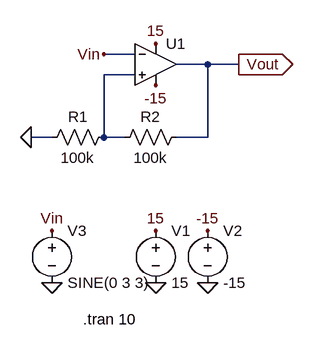
[diagram p0: schematic 1-4.asc]
1-4.asc, the LTspice schematic file:
Version 4
SHEET 1 880 680
WIRE 112 48 64 48
WIRE 224 64 176 64
WIRE 272 64 224 64
WIRE 112 80 64 80
WIRE -16 176 -48 176
WIRE 64 176 64 80
WIRE 96 176 64 176
WIRE 224 176 224 64
WIRE 224 176 176 176
FLAG 144 400 0
FLAG 224 400 0
FLAG 144 320 15
FLAG 224 320 -15
FLAG 144 96 -15
FLAG 144 32 15
FLAG 64 48 Vin
FLAG -48 176 0
FLAG 272 64 Vout
IOPIN 272 64 Out
FLAG -16 320 Vin
FLAG -16 400 0
SYMBOL OpAmps\\UniversalOpAmp2 144 64 R0
SYMATTR InstName U1
SYMBOL voltage 144 304 R0
SYMATTR InstName V1
SYMATTR Value 15
SYMBOL voltage 224 304 R0
SYMATTR InstName V2
SYMATTR Value -15
SYMBOL res 80 160 R90
WINDOW 0 0 56 VBottom 2
WINDOW 3 32 56 VTop 2
SYMATTR InstName R1
SYMATTR Value 100k
SYMBOL res 192 160 R90
WINDOW 0 0 56 VBottom 2
WINDOW 3 32 56 VTop 2
SYMATTR InstName R2
SYMATTR Value 100k
SYMBOL voltage -16 304 R0
WINDOW 123 24 124 Left 2
WINDOW 39 0 0 Left 0
SYMATTR InstName V3
SYMATTR Value SINE(0 3 3)
TEXT 32 456 Left 2 !.tran 10

The netlist it stands for:
* 1-4.asc
XU1 N001 Vin 15 -15 Vout level2 Avol=1Meg GBW=10Meg Slew=10Meg Ilimit=25m Rail=0 Vos=0 En=0 Enk=0 In=0 Ink=0 Rin=500Meg  ; pins In+ In- V+ V- OUT
V1 15 0 15
V2 -15 0 -15
R1 N001 0 100k
R2 Vout N001 100k
V3 Vin 0 SINE(0 3 3)
.tran 10
.lib UniversalOpAmp2.lib
.backanno
.end

* Results of the author's LTspice run, read from the files saved beside the schematic
* Operating Point, zero values left out:
*   V(15) = 15 V
*   V(-15) = -15 V
*   I(V1) = -1.498 mA
*   I(V2) = 1.498 mA
*   Ix(u1:3) = 1.498 mA
*   Ix(u1:4) = -1.498 mA
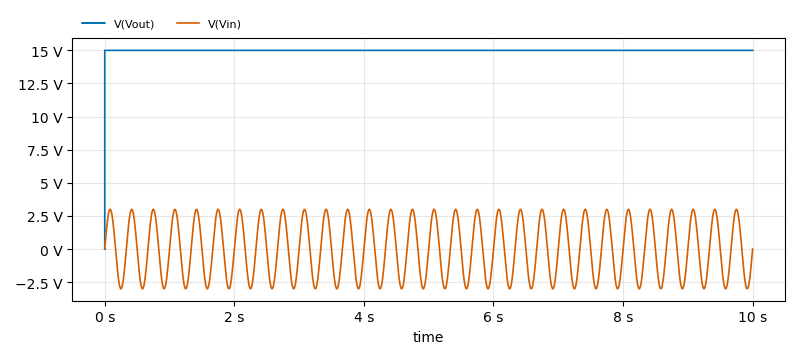
[diagram p1: Transient Analysis of 1-4.asc, plotted from the saved traces]
* Transient Analysis, 1 run:
*   V(Vout): min -6.352 mV, max 15 V, average 15 V, rms 15 V, last 15 V
*   V(Vin): min -3 V, max 3 V, average 3.277 µV, rms 2.122 V, last 0 V